# Altium schematic sheet Motors.SchDoc
size A4; SheetNumber: 2; SheetTotal: 4
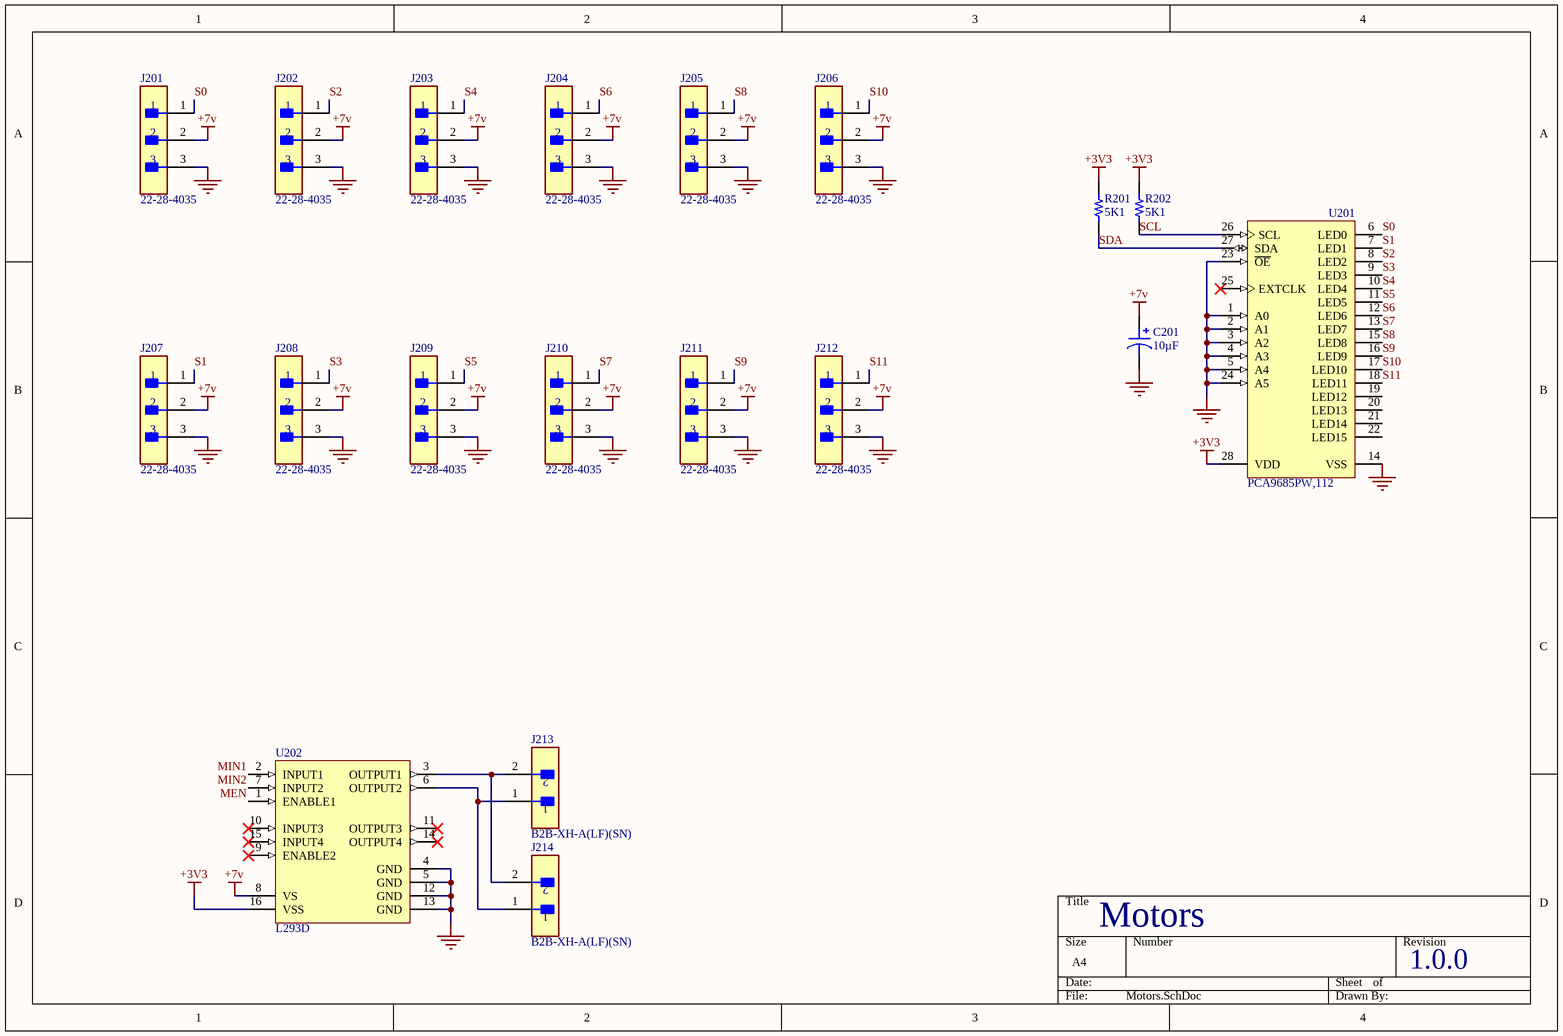
[diagram p0: Motors.SchDoc]

## Parts
C201  10µF  [CAP TH ALUM ELEC D10.00mm S5.00mm H12.50mm]
J201  22-28-4035  [FP-22-28-4035-MFG]
J202  22-28-4035  [FP-22-28-4035-MFG]
J203  22-28-4035  [FP-22-28-4035-MFG]
J204  22-28-4035  [FP-22-28-4035-MFG]
J205  22-28-4035  [FP-22-28-4035-MFG]
J206  22-28-4035  [FP-22-28-4035-MFG]
J207  22-28-4035  [FP-22-28-4035-MFG]
J208  22-28-4035  [FP-22-28-4035-MFG]
J209  22-28-4035  [FP-22-28-4035-MFG]
J210  22-28-4035  [FP-22-28-4035-MFG]
J211  22-28-4035  [FP-22-28-4035-MFG]
J212  22-28-4035  [FP-22-28-4035-MFG]
J213  B2B-XH-A(LF)(SN)  [FP-B2B-XH-A_LF_SN-MFG]
J214  B2B-XH-A(LF)(SN)  [FP-B2B-XH-A_LF_SN-MFG]
R201  5K1  [RES 0402_1005]
R202  5K1  [RES 0402_1005]
U201  PCA9685PW,112  [SOT361-1_V]
U202  L293D  [STM-L293D-16]

## Nets
+3V3: R201.2 R202.1 U201.28(VDD) U202.16(VSS)
+7v: C201.1 J201.2 J202.2 J203.2 J204.2 J205.2 J206.2 J207.2 J208.2 J209.2 J210.2 J211.2 J212.2 U202.8(VS)
GND: C201.2 J201.3 J202.3 J203.3 J204.3 J205.3 J206.3 J207.3 J208.3 J209.3 J210.3 J211.3 J212.3 U201.1(A0) U201.2(A1) U201.3(A2) U201.4(A3) U201.5(A4) U201.14(VSS) U201.23(~{OE}) U201.24(A5) U202.4(GND) U202.5(GND) U202.12(GND) U202.13(GND)
MEN: U202.1(ENABLE1)
MIN1: U202.2(INPUT1)
MIN2: U202.7(INPUT2)
S0: J201.1 U201.6(LED0)
S1: J207.1 U201.7(LED1)
S2: J202.1 U201.8(LED2)
S3: J208.1 U201.9(LED3)
S4: J203.1 U201.10(LED4)
S5: J209.1 U201.11(LED5)
S6: J204.1 U201.12(LED6)
S7: J210.1 U201.13(LED7)
S8: J205.1 U201.15(LED8)
S9: J211.1 U201.16(LED9)
S10: J206.1 U201.17(LED10)
S11: J212.1 U201.18(LED11)
SCL: R202.2 U201.26(SCL)
SDA: R201.1 U201.27(SDA)
NetJ213_1: J213.1 J214.1 U202.6(OUTPUT2)
NetJ213_2: J213.2 J214.2 U202.3(OUTPUT1)

Not connected (* = marked no-connect by the designer): U201 19(LED12) 20(LED13) 21(LED14) 22(LED15) 25(EXTCLK)*; U202 9(ENABLE2)* 10(INPUT3)* 11(OUTPUT3)* 14(OUTPUT4)* 15(INPUT4)*

## Notes on the sheet
- Motors
- 1.0.0

## Library data of the parts
C201 = UVR2D100MPD: CAP ALUM 10UF 20% 200V RADIAL; manufacturer: Nichicon; Lifetime @ Temp.: 2000 Hrs @ 85°C; Polarization: Polar; Ripple Current @ High Frequency: 152mA @ 10kHz; Ripple Current @ Low Frequency: 95mA @ 120Hz; Part Number: UVR2D100MPD; Applications: General Purpose; Capacitance: 10µF; componentlink1description: Datasheet; componentlink1url: http://nichicon-us.com/english/products/pdfs/e-uvr.pdf; componentlink2description: DigiKey Link; componentlink2url: http://digikey.com/product-detail/en/nichicon/UVR2D100MPD/493-1177-ND/588918; Device Package: Radial, Can; Height - Seated (Max): 0.492" (12.50mm); lastupdated: 2/09/2020 1:31:04 AM; Lead Spacing: 0.197" (5.00mm); Lifecycle Status: Active; Minimum Order: 1; Mounting Type: Through Hole; Operating Temperature: -40°C ~ 85°C; Package / Case: Radial, Can; packaging: Bulk; partid: 10668; Part Status: Active; price: 0.45; series: UVR; Size / Dimension: 0.394" Dia (10.00mm); Supplier 1: DigiKey; Supplier Part Number 1: 493-1177-ND; Tolerance: ±20%; value: 10µF; Voltage - Rated: 200V
J201-J212 = CMP-00257-00247547-1: 22-28-4035 BOARD-BOARD Connector HEADER, 3WAY, 1ROW; Series: KK; Pitch Spacing: 2.54mm; No. of Rows: 1;; Manufacturer Lifecycle Status: ACTIVE; NexarPartId: 247547; Plating: Tin; Max Voltage Rating (DC): 250.25kV; Voltage Rating: 250V; Current Rating: 4A; Gender: Male; Glow Wire Compliant: Non-compliant; Number of Positions: 3; Connector Type: Male Pin; Contact Resistance: 20mΩ; Color: Black; Contact Plating: Gold; Contact Material: Brass; Lead Free: Lead Free; Number of Rows: 1; Housing Material: Thermoplastic; Min Operating Temperature: 0°C; Country of Origin: US; REACH SVHC: Unknown; Lifecycle Status: Production; Mount: Through Hole; Schedule B: 8536694040; RoHS: Compliant; Termination: Through Hole; Max Operating Temperature: 75°C; Pitch: 2.54mm; Packaging: Bulk; Number of Circuits: 3; Contact Mating Length: 7.493mm; Orientation: Vertical; Housing Color: Black; Number of Contacts: 3
J213 J214 = CMP-2000-05888-3: CONN HEADER VERT 2POS 2.5MM; Current Rating: 3A; Voltage Rating: 250V; Number of Contacts: 2; Contact Resistance: 20mR; Wire/Cable Gauge: 22AWG; Insulation Resistance: 1GR; Connector Type: Male Pin; Packaging: Bulk; Contact Material: Brass; Lead Free: Lead Free; Orientation: Straight; Contact Plating: Tin; Max Current Rating: 3A; Termination: Solder; Fastening Type: Detent; Depth: 5.75mm; Housing Material: Polyamide; REACH SVHC: No SVHC; Series: XH; Voltage Rating (AC): 250V; Number of Positions: 2; Color: Natural; Contact Type: Male Pin; Max Voltage Rating (DC): 250V; Pitch: 2.5mm; Lead Pitch: 2.5mm; Mount: Through Hole; Max Operating Temperature: 85°C; Length: 7.4mm; Max Voltage Rating (AC): 250V; Min Operating Temperature: -25°C; Number of Rows: 1; Housing Color: White
R201 R202 = AC0402JR-075K1L: RES SMD 5.1K OHM 5% 1/16W 0402; Manufacturer: Yageo; Power (Watts): 0.063W, 1/16W; Resistance: 5.1 kOhms; Temperature Coefficient: ±100ppm/°C; Part Number: AC0402JR-075K1L; Value: 5K1; ComponentLink1Description: Datasheet; ComponentLink1URL: https://www.yageo.com/upload/media/product/productsearch/datasheet/rchip/PYu-AC_51_RoHS_L_7.pdf; ComponentLink2Description: DigiKey Link; ComponentLink2URL: https://www.digikey.com/en/products/detail/yageo/AC0402JR-075K1L/5895695; Composition: Thick Film; Device Package: 0402 (1005 Metric); Features: Automotive AEC-Q200, Moisture Resistant; Height - Seated (Max): 0.015" (0.37mm); LastUpdated: 9/02/2024 8:30:14 PM; Lifecycle Status: Active; Minimum Order: 1; Number of Terminations: 2; Operating Temperature: -55°C ~ 155°C; Package / Case: 0402 (1005 Metric); Packaging: CutTape; PartId: 4690; Part Status: Active; Price: 0.01; Ratings: AEC-Q200; Series: AC; Size / Dimension: 0.039" L x 0.020" W (1.00mm x 0.50mm); Supplier 1: DigiKey; Supplier Part Number 1: YAG3554CT-ND; Supplier Device Package: 0402; Tolerance: ±5%
U201 = CMP-1595-00004-2: 16-Channel, 12-Bit PWM Fm+ I2C-Bus LED Controller, 2.3 to 5.5 V, -40 to 85 degC, 28-Pin TSSOP (SOT361-1), RoHS, Tape and Reel; Supply Current Max: 10 mA; Supply Voltage Min: 2.3 V; Supply Voltage Max: 5.5 V; Frequency: 25000000 Hz; Temperature Min: -40 degC; PackageDescription: 28-Pin Small Outline Package, Body 9.7 x 4.4 mm, Pitch 0.65 mm; RoHS: TRUE; ComponentLink1Description: Manufacturer URL; Code_JEDEC: MO-153; PartNumber: PCA9685; ComponentLink2URL: http://www.nxp.com/documents/data_sheet/PCA9685.pdf; Packing: Tape and Reel; ComponentLink1URL: http://www.nxp.com/; ComponentLink3Description: Package Specification; ComponentLink2Description: Datasheet; ComponentLink3URL: http://www.nxp.com/documents/outline_drawing/sot361-1_po.pdf; DatasheetVersion: Rev. 4; Temperature Max: 85 degC; PackageVersion: 02/2003; Mounting Technology: Surface Mount
U202 = CMP-2000-06524-1: Push-Pull Four Channel Driver with Diode, 4.5 to 36 V, -40 to 150 degC, 16-Pin PDIP, RoHS, Tube; Manufacturer: STMicroelectronics; Number of Outputs: 4; Current - Peak Output: 1.2A; Current - Output / Channel: 600mA; Input Type: Non-Inverting; Other Related Documents: L293DViewAllSpecifications; Dynamic Catalog: HalfBridge; Voltage - Supply: 4.5V~36V; Other Names: 497-2936-5; Package / Case: 16-DIP(0.300",7.62mm); PartNumber: L293D; Operating Temperature: -40°C~150°C; Datasheet URL: http://www.st.com/st-web-ui/static/active/en/resource/technical/document/datasheet/CD00000059.pdf; Supplier Device Package: 16-PowerDIP; Packaging: Tube; Package Description: 16-Pin Thru-Hole Dual-In-Line, Body 20 x 6.85 mm, Pitch 2.54 mm; Standard Package: 25; Datasheet Version: 07/2003; On-State Resistance: -; Manufacturer URL: http://www.st.com/; Category: IntegratedCircuits(ICs); Family: PMIC-MOSFET,BridgeDrivers-InternalSwitch; Type: HalfBridge; Series: -; Mounting Technology: ThroughHole; Package Reference: DIP-16; Mounting Type: ThroughHole